# Altium project DCAV32_WINGLET_V1P_OSR.PrjPcb (part 3 of 3)

## Sheet SCH_WINGLET_IO.SchDoc: Winglet Board I/O
size B; DrawnBy: HCAdam; Organization: Aerospace Village; DocumentNumber: WINGLET; Revision: A; SheetNumber: 9; SheetTotal: 10
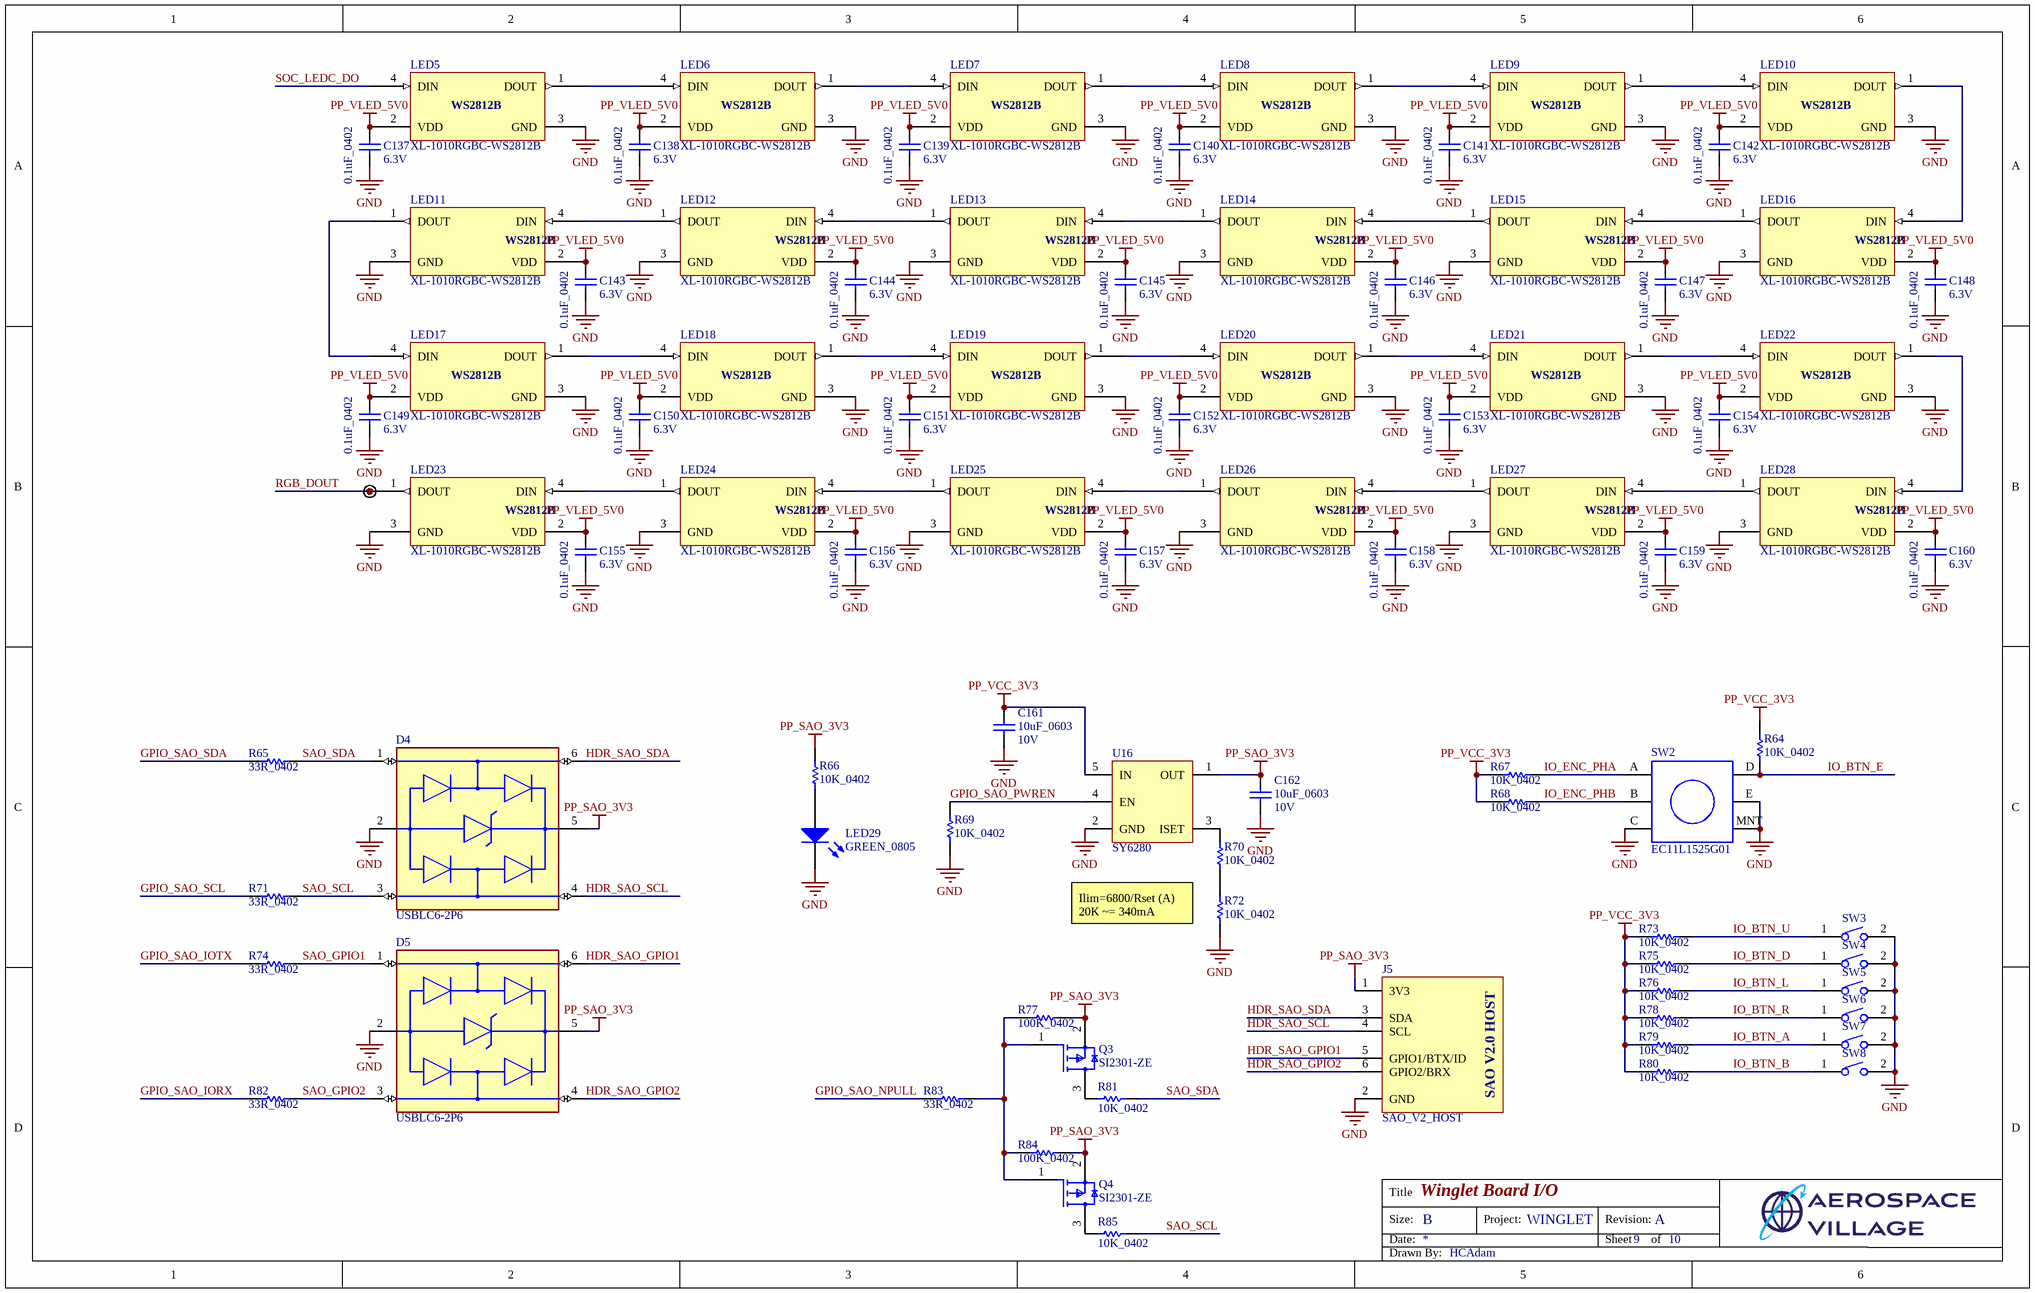
[diagram p8: SCH_WINGLET_IO.SchDoc]

### Parts
C137  0.1uF_0402  Voltage Rating: 6.3V  [CAPC1005X56X25NL10T15]
C138  0.1uF_0402  Voltage Rating: 6.3V  [CAPC1005X56X25NL10T15]
C139  0.1uF_0402  Voltage Rating: 6.3V  [CAPC1005X56X25NL10T15]
C140  0.1uF_0402  Voltage Rating: 6.3V  [CAPC1005X56X25NL10T15]
C141  0.1uF_0402  Voltage Rating: 6.3V  [CAPC1005X56X25NL10T15]
C142  0.1uF_0402  Voltage Rating: 6.3V  [CAPC1005X56X25NL10T15]
C143  0.1uF_0402  Voltage Rating: 6.3V  [CAPC1005X56X25NL10T15]
C144  0.1uF_0402  Voltage Rating: 6.3V  [CAPC1005X56X25NL10T15]
C145  0.1uF_0402  Voltage Rating: 6.3V  [CAPC1005X56X25NL10T15]
C146  0.1uF_0402  Voltage Rating: 6.3V  [CAPC1005X56X25NL10T15]
C147  0.1uF_0402  Voltage Rating: 6.3V  [CAPC1005X56X25NL10T15]
C148  0.1uF_0402  Voltage Rating: 6.3V  [CAPC1005X56X25NL10T15]
C149  0.1uF_0402  Voltage Rating: 6.3V  [CAPC1005X56X25NL10T15]
C150  0.1uF_0402  Voltage Rating: 6.3V  [CAPC1005X56X25NL10T15]
C151  0.1uF_0402  Voltage Rating: 6.3V  [CAPC1005X56X25NL10T15]
C152  0.1uF_0402  Voltage Rating: 6.3V  [CAPC1005X56X25NL10T15]
C153  0.1uF_0402  Voltage Rating: 6.3V  [CAPC1005X56X25NL10T15]
C154  0.1uF_0402  Voltage Rating: 6.3V  [CAPC1005X56X25NL10T15]
C155  0.1uF_0402  Voltage Rating: 6.3V  [CAPC1005X56X25NL10T15]
C156  0.1uF_0402  Voltage Rating: 6.3V  [CAPC1005X56X25NL10T15]
C157  0.1uF_0402  Voltage Rating: 6.3V  [CAPC1005X56X25NL10T15]
C158  0.1uF_0402  Voltage Rating: 6.3V  [CAPC1005X56X25NL10T15]
C159  0.1uF_0402  Voltage Rating: 6.3V  [CAPC1005X56X25NL10T15]
C160  0.1uF_0402  Voltage Rating: 6.3V  [CAPC1005X56X25NL10T15]
C161  10uF_0603  Voltage Rating: 10V  [CAPC1609X100X15NL20]
C162  10uF_0603  Voltage Rating: 10V  [CAPC1609X100X15NL20]
D4  USBLC6-2P6  [FP-SOT-666-MFG]
D5  USBLC6-2P6  [FP-SOT-666-MFG]
J5  SAO_V2_HOST  [SAO_FEMALE]
LED5  XL-1010RGBC-WS2812B  [DFN3127P600-8N]
LED6  XL-1010RGBC-WS2812B  [DFN3127P600-8N]
LED7  XL-1010RGBC-WS2812B  [DFN3127P600-8N]
LED8  XL-1010RGBC-WS2812B  [DFN3127P600-8N]
LED9  XL-1010RGBC-WS2812B  [DFN3127P600-8N]
LED10  XL-1010RGBC-WS2812B  [DFN3127P600-8N]
LED11  XL-1010RGBC-WS2812B  [DFN3127P600-8N]
LED12  XL-1010RGBC-WS2812B  [DFN3127P600-8N]
LED13  XL-1010RGBC-WS2812B  [DFN3127P600-8N]
LED14  XL-1010RGBC-WS2812B  [DFN3127P600-8N]
LED15  XL-1010RGBC-WS2812B  [DFN3127P600-8N]
LED16  XL-1010RGBC-WS2812B  [DFN3127P600-8N]
LED17  XL-1010RGBC-WS2812B  [DFN3127P600-8N]
LED18  XL-1010RGBC-WS2812B  [DFN3127P600-8N]
LED19  XL-1010RGBC-WS2812B  [DFN3127P600-8N]
LED20  XL-1010RGBC-WS2812B  [DFN3127P600-8N]
LED21  XL-1010RGBC-WS2812B  [DFN3127P600-8N]
LED22  XL-1010RGBC-WS2812B  [DFN3127P600-8N]
LED23  XL-1010RGBC-WS2812B  [DFN3127P600-8N]
LED24  XL-1010RGBC-WS2812B  [DFN3127P600-8N]
LED25  XL-1010RGBC-WS2812B  [DFN3127P600-8N]
LED26  XL-1010RGBC-WS2812B  [DFN3127P600-8N]
LED27  XL-1010RGBC-WS2812B  [DFN3127P600-8N]
LED28  XL-1010RGBC-WS2812B  [DFN3127P600-8N]
LED29  GREEN_0805  [0805_A]
Q3  SI2301-ZE  [FP-SOT23-MFG]
Q4  SI2301-ZE  [FP-SOT23-MFG]
R64  10K_0402  [RESC1005X40X25NL05T05]
R65  33R_0402  [RESC1005X40X25NL05T05]
R66  10K_0402  [RESC1005X40X25NL05T05]
R67  10K_0402  [RESC1005X40X25NL05T05]
R68  10K_0402  [RESC1005X40X25NL05T05]
R69  10K_0402  [RESC1005X40X25NL05T05]
R70  10K_0402  [RESC1005X40X25NL05T05]
R71  33R_0402  [RESC1005X40X25NL05T05]
R72  10K_0402  [RESC1005X40X25NL05T05]
R73  10K_0402  [RESC1005X40X25NL05T05]
R74  33R_0402  [RESC1005X40X25NL05T05]
R75  10K_0402  [RESC1005X40X25NL05T05]
R76  10K_0402  [RESC1005X40X25NL05T05]
R77  100K_0402  [RESC1005X40X25NL05T10]
R78  10K_0402  [RESC1005X40X25NL05T05]
R79  10K_0402  [RESC1005X40X25NL05T05]
R80  10K_0402  [RESC1005X40X25NL05T05]
R81  10K_0402  [RESC1005X40X25NL05T05]
R82  33R_0402  [RESC1005X40X25NL05T05]
R83  33R_0402  [RESC1005X40X25NL05T05]
R84  100K_0402  [RESC1005X40X25NL05T10]
R85  10K_0402  [RESC1005X40X25NL05T05]
SW2  EC11L1525G01  [LCSC_ALPS_EC11L1525G01]
SW3  C5127964  [LCSC_SMD_SW_MED]  (value not drawn)
SW4  C5127964  [LCSC_SMD_SW_MED]  (value not drawn)
SW5  C5127964  [LCSC_SMD_SW_MED]  (value not drawn)
SW6  C5127964  [LCSC_SMD_SW_MED]  (value not drawn)
SW7  C5127964  [LCSC_SMD_SW_MED]  (value not drawn)
SW8  C5127964  [LCSC_SMD_SW_MED]  (value not drawn)
TP28  TESTPOINT  [TESTPOINT-0.7MM-SINGLE-LAYER]  (value not drawn)  (no BOM)
U16  SY6280  [SOT95P292X115-5N]

### Nets
GND: C137.1 C138.1 C139.1 C140.1 C141.1 C142.1 C143.1 C144.1 C145.1 C146.1 C147.1 C148.1 C149.1 C150.1 C151.1 C152.1 C153.1 C154.1 C155.1 C156.1 C157.1 C158.1 C159.1 C160.1 C161.1 C162.1 D4.2(GND) D5.2(GND) J5.2(GND) LED5.3(GND) LED6.3(GND) LED7.3(GND) LED8.3(GND) LED9.3(GND) LED10.3(GND) LED11.3(GND) LED12.3(GND) LED13.3(GND) LED14.3(GND) LED15.3(GND) LED16.3(GND) LED17.3(GND) LED18.3(GND) LED19.3(GND) LED20.3(GND) LED21.3(GND) LED22.3(GND) LED23.3(GND) LED24.3(GND) LED25.3(GND) LED26.3(GND) LED27.3(GND) LED28.3(GND) LED29.1(K) R69.2 R72.2 SW2.C SW2.E SW2.MNT SW3.2 SW4.2 SW5.2 SW6.2 SW7.2 SW8.2 U16.2(GND)
PP_SAO_3V3: C162.2 D4.5(VBUS) D5.5(VBUS) J5.1(3V3) Q3.2(S) Q4.2(S) R66.2 R77.2 R84.2 U16.1(OUT)
PP_VCC_3V3: C161.2 R64.2 R67.2 R68.1 R73.2 R75.2 R76.2 R78.2 R79.2 R80.2 U16.5(IN)
PP_VLED_5V0: C137.2 C138.2 C139.2 C140.2 C141.2 C142.2 C143.2 C144.2 C145.2 C146.2 C147.2 C148.2 C149.2 C150.2 C151.2 C152.2 C153.2 C154.2 C155.2 C156.2 C157.2 C158.2 C159.2 C160.2 LED5.2(VDD) LED6.2(VDD) LED7.2(VDD) LED8.2(VDD) LED9.2(VDD) LED10.2(VDD) LED11.2(VDD) LED12.2(VDD) LED13.2(VDD) LED14.2(VDD) LED15.2(VDD) LED16.2(VDD) LED17.2(VDD) LED18.2(VDD) LED19.2(VDD) LED20.2(VDD) LED21.2(VDD) LED22.2(VDD) LED23.2(VDD) LED24.2(VDD) LED25.2(VDD) LED26.2(VDD) LED27.2(VDD) LED28.2(VDD)
GPIO_SAO_IORX: R82.1
GPIO_SAO_IOTX: R74.1
GPIO_SAO_NPULL: R83.1
GPIO_SAO_PWREN: R69.1 U16.4(EN)
GPIO_SAO_SCL: R71.1
GPIO_SAO_SDA: R65.1
HDR_SAO_GPIO1: D5.6(I/O1) J5.5(GPIO1/BTX/ID)
HDR_SAO_GPIO2: D5.4(I/O2) J5.6(GPIO2/BRX)
HDR_SAO_SCL: D4.4(I/O2) J5.4(SCL)
HDR_SAO_SDA: D4.6(I/O1) J5.3(SDA)
IO_BTN_A: R79.1 SW7.1
IO_BTN_B: R80.1 SW8.1
IO_BTN_D: R75.1 SW4.1
IO_BTN_E: R64.1 SW2.D
IO_BTN_L: R76.1 SW5.1
IO_BTN_R: R78.1 SW6.1
IO_BTN_U: R73.1 SW3.1
IO_ENC_PHA: R67.1 SW2.A
IO_ENC_PHB: R68.2 SW2.B
RGB_DOUT: LED23.1(DOUT) TP28.1
SAO_GPIO1: D5.1(I/O1) R74.2
SAO_GPIO2: D5.3(I/O2) R82.2
SAO_SCL: D4.3(I/O2) R71.2 R85.1
SAO_SDA: D4.1(I/O1) R65.2 R81.1
SOC_LEDC_DO: LED5.4(DIN)
NetLED5_1: LED5.1(DOUT) LED6.4(DIN)
NetLED6_1: LED6.1(DOUT) LED7.4(DIN)
NetLED7_1: LED7.1(DOUT) LED8.4(DIN)
NetLED8_1: LED8.1(DOUT) LED9.4(DIN)
NetLED9_1: LED9.1(DOUT) LED10.4(DIN)
NetLED10_1: LED10.1(DOUT) LED16.4(DIN)
NetLED11_1: LED11.1(DOUT) LED17.4(DIN)
NetLED11_4: LED11.4(DIN) LED12.1(DOUT)
NetLED12_4: LED12.4(DIN) LED13.1(DOUT)
NetLED13_4: LED13.4(DIN) LED14.1(DOUT)
NetLED14_4: LED14.4(DIN) LED15.1(DOUT)
NetLED15_4: LED15.4(DIN) LED16.1(DOUT)
NetLED17_1: LED17.1(DOUT) LED18.4(DIN)
NetLED18_1: LED18.1(DOUT) LED19.4(DIN)
NetLED19_1: LED19.1(DOUT) LED20.4(DIN)
NetLED20_1: LED20.1(DOUT) LED21.4(DIN)
NetLED21_1: LED21.1(DOUT) LED22.4(DIN)
NetLED22_1: LED22.1(DOUT) LED28.4(DIN)
NetLED23_4: LED23.4(DIN) LED24.1(DOUT)
NetLED24_4: LED24.4(DIN) LED25.1(DOUT)
NetLED25_4: LED25.4(DIN) LED26.1(DOUT)
NetLED26_4: LED26.4(DIN) LED27.1(DOUT)
NetLED27_4: LED27.4(DIN) LED28.1(DOUT)
NetLED29_2: LED29.2(A) R66.1
NetQ3_1: Q3.1(G) Q4.1(G) R77.1 R83.2 R84.1
NetQ3_3: Q3.3(D) R81.2
NetQ4_3: Q4.3(D) R85.2
NetR70_1: R70.1 U16.3(ISET)
NetR70_2: R70.2 R72.1

### Notes on the sheet
- Ilim=6800/Rset (A)
  20K ~= 340mA
- Title
- Size:
- Date:
- B
- Project:
- Revision:
- Sheet
- of
- Drawn By:
- (in symbol SAO_V2_HOST) SAO V2.0 HOST
- (in symbol XL-1010RGBC-WS2812B) WS2812B

### Library data of the parts
C137-C160 = CMP-2008-02743-1: 04026D104KAT2A; Manufacturer: AVX Interconnect / Elco; Part Number: 04026D104KAT2A
C161 C162 = CMP-2006-00191-1: Part Number: TACL106M006XTA; Manufacturer: AVX Interconnect / Elco
D4 D5 = CMP-12225-000058-1: TVS DIODE 5.25V 17V SOT666; Min Breakdown Voltage: 6V; Power Line Protection: Yes; Element Configuration: Dual; Test Current: 1mA; Working Voltage: 5V; Number of Channels: 2; Max Reverse Leakage Current: 150nA; Direction: Unidirectional; Peak Pulse Current: 5A; Number of Elements: 1; Capacitance: 3.5pF; Max Breakdown Voltage: 6V; Height: 0.6mm; Depth: 1.3mm; Contact Plating: Tin; Reverse Breakdown Voltage: 6V; REACH SVHC: No SVHC; Operating Supply Voltage: 5V; Width: 1.3mm; Max Operating Temperature: 125°C; Reverse Standoff Voltage: 5V; ESD Protection: Yes; Package Quantity: 1; Termination: SMD/SMT; Length: 1.7mm; Leakage Current: 150nA; Number of Bidirectional Channels: 2; Case/Package: SOT-666; Min Operating Temperature: -40°C; Number of Pins: 6; Clamping Voltage: 17V; Breakdown Voltage: 6V; Lead Free: Lead Free; Radiation Hardening: No; Packaging: Tape and Reel; Mount: Surface Mount; Polarity: Unidirectional
J5 = SAO_V2_HOST: SAO V2 Host (Female) Side
LED5-LED28 = XL-1010RGBC-WS2812B: 1010 RGB WS2812B LED 3.5-5.5V
LED29 = CMP-1426-00007-1: SMD mono-color Chip LED, WL-SMCW, Green / 150080GS75000; Manufacturer: Wuerth Elektronik; PackageReference: 0805_A; Color: Green; PartNumber: 150080GS75000; ComponentLink2URL: http://katalog.we-online.com/led/datasheet/150080GS75000.pdf; ComponentLink1URL: http://www.we-online.com; ComponentLink1Description: Manufacturer URL; ComponentLink2Description: Datasheet
Q3 Q4 = CMP-12801-000062-2: MOSFET P-CH 30V SOT23; Gate to Source Voltage (Vgs): 20V; Turn-Off Delay Time: 31ns; Drain to Source Voltage (Vdss): -30V; Fall Time: 15ns; Threshold Voltage: -2.1V; Rise Time: 5ns; Input Capacitance: 563pF; Number of Channels: 1; Drain to Source Resistance: 65mR; Element Configuration: Single; Max Power Dissipation: 1.08W; Turn-On Delay Time: 4.8ns; Continuous Drain Current (ID): 3.8A; Lead Free: Lead Free; Number of Pins: 3; Package Quantity: 3000; Width: 1.4mm; Radiation Hardening: No; Mount: Surface Mount; Case/Package: SOT-23; Contact Plating: Tin; Rds On Max: 65mR; Height: 1.1mm; REACH SVHC: No SVHC; Weight: 0.000282oz; Max Operating Temperature: 150°C; Packaging: Tape and Reel; Min Operating Temperature: -55°C; Length: 3mm
R64 R66-R70 R72 R73 R75 R76 R78-R81 R85 = CMP-2000-07588-1: Chip Resistor, 10 KOhm, +/- 1%, 0.1 W, -55 to 155 degC, 0402 (1005 Metric), RoHS, Tape and Reel / ERJ2RKF1002X; Manufacturer: Panasonic; Power Rating: 100mW; Voltage Rating: 50V; Resistance: 10KOhm; Case\/Package: 0402; Temperature Coefficient: 100ppm\/degreesC; RoHSCompliant: True; Lead Free: LeadFree; Package Quantity: 1; Contact Plating: Tin; Length: 1mm; Radiation Hardening: No; REACH SVHC: NoSVHC; Max Operating Temperature: 155degC; Depth: 0.5mm; Case Code (Imperial): 0402; Military Standard: Not; Package Description: 2-Pin Surface Mount Device, Body 1 x 0.5 mm; Termination: SMD/SMT; Case Code (Metric): 1005; Height: 0.35mm; Packaging: TapeandReel; Voltage Rating (DC): 50V; Package Reference: 402; Number of Pins: 2; Tolerance: 1%; Mounting Technology: SurfaceMount; Width: 0.02inch; Mount: SurfaceMount; Datasheet URL: https://industrial.panasonic.com/cdbs/www-data/pdf/RDA0000/AOA0000C304.pdf; Composition: ThickFilm; Datasheet Version: 02/2017; Manufacturer URL: http://www.panasonic.com/; Max Power Dissipation: 100mW; Number of Terminations: 2; Min Operating Temperature: -55degC
R65 R71 R74 R82 R83 = CMP-2002-01146-1: ERJ2RKF33R0X; Manufacturer: Panasonic; Part Number: ERJ2RKF33R0X
R77 R84 = CMP-2002-07343-1: RC0402FR-07100KL; Manufacturer: Yageo / Phycomp; Part Number: RC0402FR-07100KL
SW2 = EC11L1525G01: EC11L1525G01 Rotary Encoder with Pushbutton
SW3-SW8 = SMD_SW_MED: SMD SPST Tactile Switch / C5127964
TP28 = TP_07: TESTPOINT SINGLE LAYER 0.7MM; AEC-Q: Yes; PPAP: Unknown; Selective Soldering: No; Value: Unknown; RoHS: Yes; Package: BOARD_FEATURE; Washable: Yes; Mounting: Unknown
U16 = SY6280: Low Loss Power Distribution Switch

## Sheet SCH_WINGLET_DEBUG.SchDoc: Winglet Debug
size B; DrawnBy: HCAdam; Organization: Aerospace Village; DocumentNumber: WINGLET; Revision: A; SheetNumber: 10; SheetTotal: 10
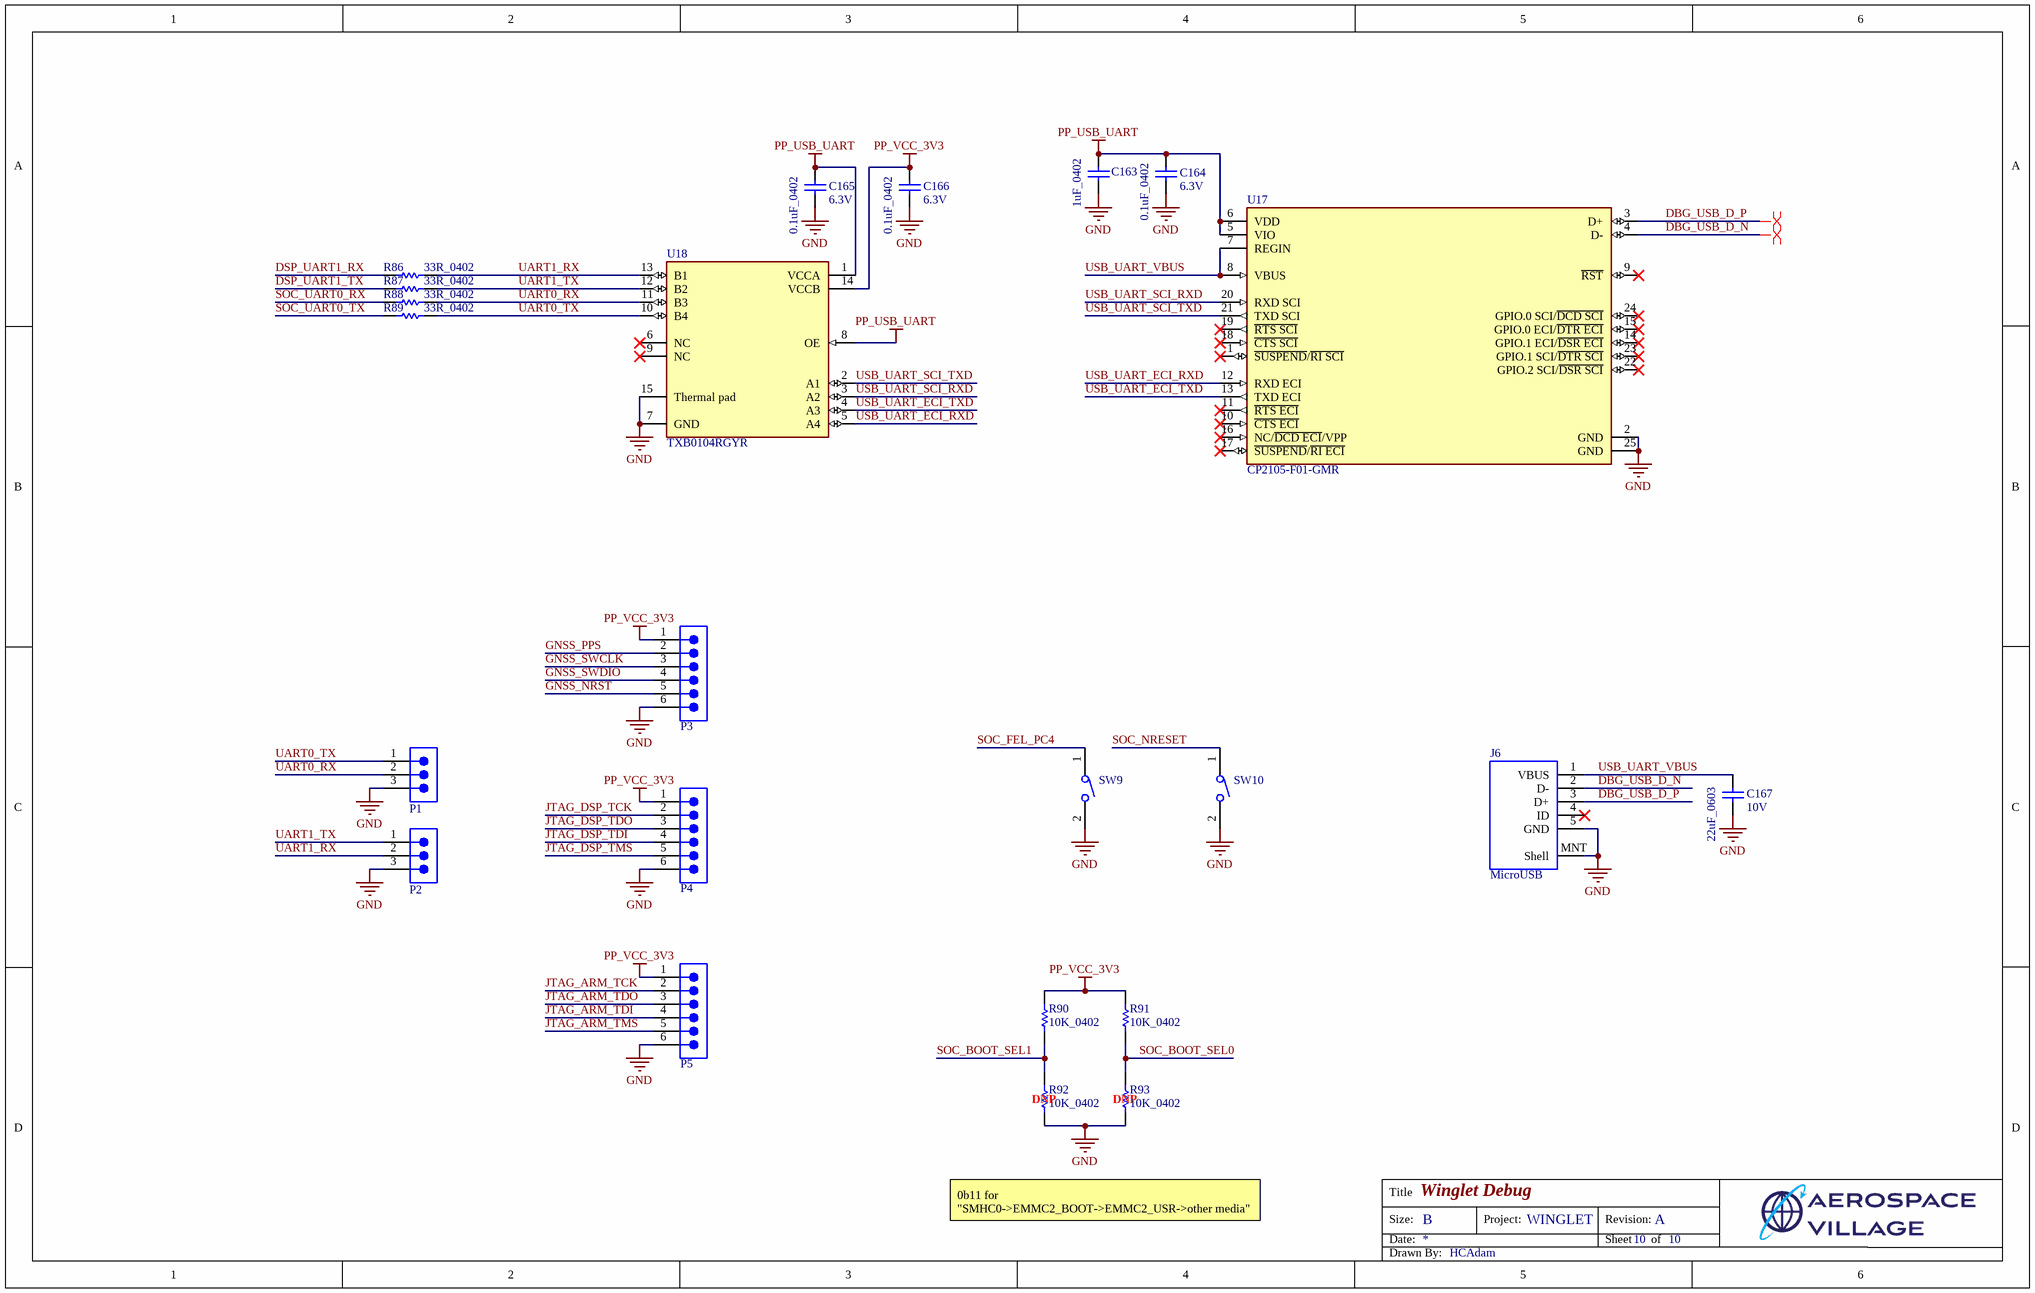
[diagram p9: SCH_WINGLET_DEBUG.SchDoc]

### Parts
C163  1uF_0402  [CAPC1005X55X25NL5T10]
C164  0.1uF_0402  Voltage Rating: 6.3V  [CAPC1005X56X25NL10T15]
C165  0.1uF_0402  Voltage Rating: 6.3V  [CAPC1005X56X25NL10T15]
C166  0.1uF_0402  Voltage Rating: 6.3V  [CAPC1005X56X25NL10T15]
C167  22uF_0603  Voltage Rating: 10V  [CAPC1608X100X20NL10]
J6  MicroUSB  [LCSC_MicroQTJ]
P1  TSW-103-07-G-S  [SMTC-TSW-103-07-X-S]  (value not drawn)
P2  TSW-103-07-G-S  [SMTC-TSW-103-07-X-S]  (value not drawn)
P3  TSW-106-07-F-S  [SMTC-TSW-106-07-X-S]  (value not drawn)
P4  TSW-106-07-F-S  [SMTC-TSW-106-07-X-S]  (value not drawn)
P5  TSW-106-07-F-S  [SMTC-TSW-106-07-X-S]  (value not drawn)
R86  33R_0402  [RESC1005X40X25NL05T05]
R87  33R_0402  [RESC1005X40X25NL05T05]
R88  33R_0402  [RESC1005X40X25NL05T05]
R89  33R_0402  [RESC1005X40X25NL05T05]
R90  10K_0402  [RESC1005X40X25NL05T05]
R91  10K_0402  [RESC1005X40X25NL05T05]
R92  10K_0402  [RESC1005X40X25NL05T05]
R93  10K_0402  [RESC1005X40X25NL05T05]
SW9  GT-TC029B-H025-L1N  [LCSC_SMD_SW_SMALL]  (value not drawn)
SW10  GT-TC029B-H025-L1N  [LCSC_SMD_SW_SMALL]  (value not drawn)
U17  CP2105-F01-GMR  [FP-CP2105-F01-GMR-MFG]
U18  TXB0104RGYR  [FP-RGY0014A-MFG]

### Nets
GND: C163.1 C164.1 C165.1 C166.1 C167.1 J6.5(GND) J6.MNT(Shell) P1.3 P2.3 P3.6 P4.6 P5.6 R92.2 R93.2 SW9.2 SW10.2 U17.2(GND) U17.25(GND) U18.7(GND) U18.15(Thermal_pad)
PP_USB_UART: C163.2 C164.2 C165.2 U17.5(VIO) U17.6(VDD) U18.1(VCCA) U18.8(OE)
PP_VCC_3V3: C166.2 P3.1 P4.1 P5.1 R90.1 R91.1 U18.14(VCCB)
DBG_USB_D_N: J6.2(D-) U17.4(D-)
DBG_USB_D_P: J6.3(D+) U17.3(D+)
DSP_UART1_RX: R86.1
DSP_UART1_TX: R87.1
GNSS_NRST: P3.5
GNSS_PPS: P3.2
GNSS_SWCLK: P3.3
GNSS_SWDIO: P3.4
JTAG_ARM_TCK: P5.2
JTAG_ARM_TDI: P5.4
JTAG_ARM_TDO: P5.3
JTAG_ARM_TMS: P5.5
JTAG_DSP_TCK: P4.2
JTAG_DSP_TDI: P4.4
JTAG_DSP_TDO: P4.3
JTAG_DSP_TMS: P4.5
SOC_BOOT_SEL0: R91.2 R93.1
SOC_BOOT_SEL1: R90.2 R92.1
SOC_FEL_PC4: SW9.1
SOC_NRESET: SW10.1
SOC_UART0_RX: R88.1
SOC_UART0_TX: R89.1
UART0_RX: P1.2 R88.2 U18.11(B3)
UART0_TX: P1.1 R89.2 U18.10(B4)
UART1_RX: P2.2 R86.2 U18.13(B1)
UART1_TX: P2.1 R87.2 U18.12(B2)
USB_UART_ECI_RXD: U17.12(RXD_ECI) U18.5(A4)
USB_UART_ECI_TXD: U17.13(TXD_ECI) U18.4(A3)
USB_UART_SCI_RXD: U17.20(RXD_SCI) U18.3(A2)
USB_UART_SCI_TXD: U17.21(TXD_SCI) U18.2(A1)
USB_UART_VBUS: C167.2 J6.1(VBUS) U17.7(REGIN) U17.8(VBUS)

Not connected (* = marked no-connect by the designer): J6 4(ID)*; U17 1(~{SUSPEND}/~{RI_SCI})* 9(~{RST})* 10(~{CTS_ECI})* 11(~{RTS_ECI})* 14(GPIO.1_ECI/~{DSR_ECI})* 15(GPIO.0_ECI/~{DTR_ECI})* 16(NC/~{DCD_ECI}/VPP)* 17(~{SUSPEND}/~{RI_ECI})* 18(~{CTS_SCI})* 19(~{RTS_SCI})* 22(GPIO.2_SCI/~{DSR_SCI})* 23(GPIO.1_SCI/~{DTR_SCI})* 24(GPIO.0_SCI/~{DCD_SCI})*; U18 6(NC)* 9(NC)*

### Layout directives
differential pair: DBG_USB_D_N, DBG_USB_D_P

### Notes on the sheet
- 0b11 for "SMHC0->EMMC2_BOOT->EMMC2_USR->other media"
- Title
- Size:
- Date:
- B
- Project:
- Revision:
- Sheet
- of
- Drawn By:

### Library data of the parts
C163 = CMP-1662-00020-1: Chip Capacitor, 1 uF, +/- 10%, 6.3 V, -55 to 85 degC, 0402 (1005 Metric), RoHS, Tape and Reel / GRM155R60J105KE19D; Voltage Rating (DC): 3 V; Type (Capacitors): X5R; Voltage Rating: 6.3 V; Capacitance: 1 uF; ComponentLink2Description: Datasheet; ComponentLink2URL: http://psearch.en.murata.com/capacitor/product/GRM155R60J105KE19%23.pdf; Max Operating Temperature: 85 degC; Min Operating Temperature: -55 degC; Package Quantity: 10000; Mounting Technology: Surface Mount; ComponentLink1Description: Manufacturer URL; ComponentLink1URL: http://www.murata.com/; PackageDescription: 2-Pin Surface Mount Device, Body 1 x 0.5 mm; Tolerance: 10%; Case/Package: 0402; Mount: Surface Mount; Packaging: Tape and Reel; Case Code (Metric): 1005; Radiation Hardening: No; Width: 0.5 mm; Length: 1 mm; DatasheetVersion: 08/2016; Height: 0.5 mm; PartNumber: GRM155R60J105KE19D; RoHSCompliant: true; Case Code (Imperial): 0402; REACH SVHC: No SVHC; Pins: 2
C164-C166 = CMP-2008-02743-1: as C137-C160 on sheet SCH_WINGLET_IO; Part Number: 04026D104KAT2A
C167 = CMP-2000-05441-1: Chip Capacitor, 22 uF, +/- 20%, 10 V, -55 to 85 degC, 0603 (1608 Metric), RoHS, Tape and Reel / PN: C1608X5R1A226M080AC; Manufacturer: TDK; PCN Part Number: MLCCPartNumberChange30/Nov/2012; Product Training Modules: CSeriesGeneralApplicationsSEAT,CCV,andTVCLDesignToolsGuidetoReplacinganElectrolyticCapacitorwithanMLCC; Other Names: 445-9077-1; Design Resources: 20WNon-IsolatedBuckLEDDriverUsingPLLNK460KG; Online Catalog: CSeries,GeneralPurpose; Capacitance: 22µF; Temperature Coefficient: X5R; Kits: 445-9014-KIT-ND-KITMLCC100PF-22UF060310-50V; Packaging: CutTape(CT); Standard Package: 1; Package / Case: 0603(1608Metric); Lead Style: -; Features: -; Ratings: -; Voltage - Rated: 10V; Operating Temperature: -55degC~85degC; Applications: GeneralPurpose; Package Reference: 603; Datasheet URL: http://download.siliconexpert.com/pdfs/2015/4/21/15/54/45/779/tdk_/manual/37024850441143360mlcc_commercial_general_en.pdf; Datasheet Version: Mar-15; Mounting Type: SurfaceMount,MLCC; Lead Spacing: -; Size / Dimension: 0.063"Lx0.031"W(1.60mmx0.80mm); Height - Seated (Max): -; Package Description: 2-Pin Surface Mount Device, Body 1.6 x 0.8 mm; Manufacturer URL: http://www.tdk.com/; RoHS Information: RoHSCertificate-MLCC; Tolerance: ±20%; Series: C; Thickness (Max): 0.035"(0.90mm); Family: CeramicCapacitors; Category: Capacitors
J6 = MicroQTJ: MicroQTJ MicroUSB CONN
P1 P2 = CMP-1024-00333-1: 0.025" SQ Post Header, Through-hole, Vertical, -55 to 125 degC, 2.54 mm Pitch, 3-Pin, Male, RoHS; Manufacturer: Samtec; Pitch: 2.54 mm; ComponentLink3URL: http://www.samtec.com/documents/webfiles/cpdf/TSW-XXX-XX-XXX-X-XX-XXX-MKT.pdf; Temperature Range: -55 to 125 degC; DatasheetVersion: F-214; ComponentLink1Description: Manufacturer URL; ComponentLink2URL: http://www.samtec.com/documents/webfiles/pdf/TSW_TH.PDF; RoHS: True; Orientation: Vertical; ComponentLink2Description: Datasheet; ComponentLink3Description: Package Specification; PackageDescription: .025[0.64] SQ. Post Terminal Strip Assembly; Mounting Technology: Through-hole; PackageVersion: DM, 8/1988; ComponentLink1URL: http://www.samtec.com; PackageReference: TSW-103-07-X-S; PartNumber: TSW-103-07-G-S
P3-P5 = CMP-1024-00385-1: 0.025" SQ Post Header, Through-hole, Vertical, -55 to 125 degC, 2.54 mm Pitch, 6-Pin, Male, RoHS; Manufacturer: Samtec; Pitch: 2.54 mm; Orientation: Vertical; RoHS: True; ComponentLink3Description: Package Specification; PartNumber: TSW-106-07-F-S; Temperature Range: -55 to 125 degC; PackageVersion: DM, 8/1988; ComponentLink2URL: http://www.samtec.com/documents/webfiles/pdf/TSW_TH.PDF; ComponentLink1Description: Manufacturer URL; ComponentLink2Description: Datasheet; ComponentLink1URL: http://www.samtec.com; DatasheetVersion: F-214; PackageReference: TSW-106-07-X-S; PackageDescription: .025[0.64] SQ. Post Terminal Strip Assembly; ComponentLink3URL: http://www.samtec.com/documents/webfiles/cpdf/TSW-XXX-XX-XXX-X-XX-XXX-MKT.pdf; Mounting Technology: Through-hole
R86-R89 = CMP-2002-01146-1: ERJ2RKF33R0X; Manufacturer: Panasonic; Part Number: ERJ2RKF33R0X
R90-R93 = CMP-2000-07588-1: as R64 on sheet SCH_WINGLET_IO; RoHSCompliant: True; Lead Free: LeadFree; Package Quantity: 1; Contact Plating: Tin; Length: 1mm; Radiation Hardening: No; REACH SVHC: NoSVHC; Max Operating Temperature: 155degC; Depth: 0.5mm; Case Code (Imperial): 0402; Military Standard: Not; Package Description: 2-Pin Surface Mount Device, Body 1 x 0.5 mm; Termination: SMD/SMT; Case Code (Metric): 1005; Height: 0.35mm; Packaging: TapeandReel; Voltage Rating (DC): 50V; Package Reference: 402; Number of Pins: 2; Tolerance: 1%; Mounting Technology: SurfaceMount; Width: 0.02inch; Mount: SurfaceMount; Datasheet URL: https://industrial.panasonic.com/cdbs/www-data/pdf/RDA0000/AOA0000C304.pdf; Composition: ThickFilm; Datasheet Version: 02/2017; Manufacturer URL: http://www.panasonic.com/; Max Power Dissipation: 100mW; Number of Terminations: 2; Min Operating Temperature: -55degC
  R92 R93: DNP: DNP
SW9 SW10 = GT-TC029B-H025-L1N: SMD SPST Tactile Switch / C843669
U17 = CMP-08107-000002-1: IC SGL USB-DL UART BRIDGE 24QFN; Manufacturer: Silicon Labs; Standoff Height: 0mm; Max Supply Voltage: 5.25V; Min Supply Voltage: 1.8V; Function: Bridge, USB to UART; Interface: UART,USB; Nominal Supply Current: 17mA; Height: 0.8mm; Ambient Temperature Range High: +125°C; Ipc Land Pattern Name: QFN50P400X400X75-24; Mouser Description: I/O Controller Interface IC USB to Dual UART bridge; Octopart: https://octopart.com/cp2105-f01-gmr-silicon+labs-19668643; Automotive: No; RoHS: TRUE; Manufacturer Part Number: CP2105-F01-GMR; Temperature: -40°C to +85°C; Temperature Range Low: -40°C; Temperature Range High: +85°C; Category: IC; ComponentLink2Description: Datasheet; Digikey Description: IC SGL USB-DL UART BRIDGE 24QFN; Device Class L1: Integrated Circuits (ICs); Device Class L2: Interface ICs; Ambient Temperature Range Low: -55°C; Package: CP2105-F01-GMR; Device Class L3: Controllers; Lead Free: Yes; ComponentLink2URL: https://www.silabs.com/documents/public/data-sheets/CP2105.pdf
U18 = CMP-04899-000011-1: IC TRNSLTR BIDIRECTIONAL 14VQFN; Manufacturer: Texas Instruments; Standoff Height: 0mm; V B Min: 1.65V; Data Rate: 100Mbits/s; Number Of Circuits: 1; V B Max: 5.5V; Number Of Inputs: 4; Logic Function Desc: Non-Inverting; Max Junction Temp: +150°C; V A Min: 1.2V; Nominal Supply Current: 0.06-3.5uA; V A Max: 3.6V; Propagation Delay: 4ns; Device Class L1: Integrated Circuits (ICs); ComponentLink2Description: Datasheet; Mouser Description: 4-Bit Bidirectional Voltage-Level Shifter with Auto Direction Sensing and +/-15 kV ESD Protect 14-VQFN -40 to 85; Ambient Temperature Range Low: -40°C; Temperature: -40°C to +85°C; RoHS: TRUE; Digikey Description: IC TRNSLTR BIDIRECTIONAL 14VQFN; Manufacturer Part Number: TXB0104RGYR; Lead Free: Yes; Octopart: https://octopart.com/txb0104rgyr-texas+instruments-1485948; Height: 1mm; Device Class L3: Voltage Level Shifters; Category: IC; Device Class L2: Logic ICs; Temperature Range Low: -40°C; Number Of Outputs: 4; Temperature Range High: +85°C; Package: RGY0014A; Automotive: No; Ambient Temperature Range High: +85°C; Min Supply Voltage: 1.2V; ComponentLink2URL: http://www.ti.com/lit/ds/symlink/txb0104.pdf; Max Supply Voltage: 5.5V

## Nets that join several sheets
GND: SCH_WINGLET_BMU (30 pins), SCH_WINGLET_PWR (42 pins), SCH_WINGLET_SOC (19 pins), SCH_WINGLET_SD_MMC (20 pins), SCH_WINGLET_DISP (15 pins), SCH_WINGLET_WIFI (22 pins), SCH_WINGLET_GNSS (32 pins), SCH_WINGLET_ADSB (47 pins), SCH_WINGLET_IO (66 pins), SCH_WINGLET_DEBUG (20 pins)
PP_BMU_1V8: SCH_WINGLET_BMU (C16.2 R1.1 TP3.1 U1.2), SCH_WINGLET_PWR (R24.2), SCH_WINGLET_GNSS (D3.2)
PP_LDOA_1V8: SCH_WINGLET_PWR (6 pins), SCH_WINGLET_SOC (6 pins), SCH_WINGLET_DISP (C70.2 U4.65)
PP_VCC_3V3: SCH_WINGLET_BMU (R2.1 R3.1 R4.1), SCH_WINGLET_PWR (15 pins), SCH_WINGLET_SOC (6 pins), SCH_WINGLET_SD_MMC (18 pins), SCH_WINGLET_DISP (7 pins), SCH_WINGLET_WIFI (FB1.1), SCH_WINGLET_GNSS (FB2.1), SCH_WINGLET_ADSB (FB3.1), SCH_WINGLET_IO (11 pins), SCH_WINGLET_DEBUG (7 pins)
PP_VLED_5V0: SCH_WINGLET_BMU (5 pins), SCH_WINGLET_DISP (C73.2 U6.4), SCH_WINGLET_IO (48 pins)
PP_VSYS: SCH_WINGLET_BMU (6 pins), SCH_WINGLET_PWR (5 pins)
BMU_IRQ: SCH_WINGLET_BMU (R2.2 U1.29), SCH_WINGLET_SOC (U4.118)
BMU_OTG: SCH_WINGLET_BMU (R6.2 U1.3), SCH_WINGLET_SOC (U4.119)
BMU_TWI2_SCL: SCH_WINGLET_BMU (R4.2 U1.32), SCH_WINGLET_SOC (U4.126)
BMU_TWI2_SDA: SCH_WINGLET_BMU (R3.2 U1.1), SCH_WINGLET_SOC (U4.127)
DSP_UART1_RX: SCH_WINGLET_SOC (U4.2), SCH_WINGLET_DEBUG (R86.1)
DSP_UART1_TX: SCH_WINGLET_SOC (U4.1), SCH_WINGLET_DEBUG (R87.1)
GNSS_NRST: SCH_WINGLET_GNSS (U10.17), SCH_WINGLET_DEBUG (P3.5)
GNSS_PPS: SCH_WINGLET_GNSS (U10.35), SCH_WINGLET_DEBUG (P3.2)
GNSS_SWCLK: SCH_WINGLET_GNSS (U10.15), SCH_WINGLET_DEBUG (P3.3)
GNSS_SWDIO: SCH_WINGLET_GNSS (U10.16), SCH_WINGLET_DEBUG (P3.4)
GPIO_ADSB_ASW: SCH_WINGLET_SOC (U4.120), SCH_WINGLET_ADSB (R52.2 R53.2 R57.2)
GPIO_SAO_IORX: SCH_WINGLET_SOC (U4.82), SCH_WINGLET_IO (R82.1)
GPIO_SAO_IOTX: SCH_WINGLET_SOC (R27.2 U4.84), SCH_WINGLET_IO (R74.1)
GPIO_SAO_NPULL: SCH_WINGLET_SOC (U4.122), SCH_WINGLET_IO (R83.1)
GPIO_SAO_PWREN: SCH_WINGLET_SOC (U4.123), SCH_WINGLET_IO (R69.1 U16.4)
GPIO_SAO_SCL: SCH_WINGLET_SOC (U4.85), SCH_WINGLET_IO (R71.1)
GPIO_SAO_SDA: SCH_WINGLET_SOC (U4.86), SCH_WINGLET_IO (R65.1)
IO_BTN_A: SCH_WINGLET_SOC (U4.6), SCH_WINGLET_IO (R79.1 SW7.1)
IO_BTN_B: SCH_WINGLET_SOC (U4.124), SCH_WINGLET_IO (R80.1 SW8.1)
IO_BTN_D: SCH_WINGLET_SOC (U4.44), SCH_WINGLET_IO (R75.1 SW4.1)
IO_BTN_E: SCH_WINGLET_SOC (U4.5), SCH_WINGLET_IO (R64.1 SW2.D)
IO_BTN_L: SCH_WINGLET_SOC (U4.32), SCH_WINGLET_IO (R76.1 SW5.1)
IO_BTN_R: SCH_WINGLET_SOC (U4.31), SCH_WINGLET_IO (R78.1 SW6.1)
IO_BTN_U: SCH_WINGLET_SOC (U4.45), SCH_WINGLET_IO (R73.1 SW3.1)
IO_ENC_PHA: SCH_WINGLET_SOC (U4.3), SCH_WINGLET_IO (R67.1 SW2.A)
IO_ENC_PHB: SCH_WINGLET_SOC (U4.4), SCH_WINGLET_IO (R68.2 SW2.B)
JTAG_ARM_TCK: SCH_WINGLET_SOC (U4.36), SCH_WINGLET_DEBUG (P5.2)
JTAG_ARM_TDI: SCH_WINGLET_SOC (U4.38), SCH_WINGLET_DEBUG (P5.4)
JTAG_ARM_TDO: SCH_WINGLET_SOC (U4.37), SCH_WINGLET_DEBUG (P5.3)
JTAG_ARM_TMS: SCH_WINGLET_SOC (U4.39), SCH_WINGLET_DEBUG (P5.5)
JTAG_DSP_TCK: SCH_WINGLET_SOC (U4.40), SCH_WINGLET_DEBUG (P4.2)
JTAG_DSP_TDI: SCH_WINGLET_SOC (U4.42), SCH_WINGLET_DEBUG (P4.4)
JTAG_DSP_TDO: SCH_WINGLET_SOC (U4.41), SCH_WINGLET_DEBUG (P4.3)
JTAG_DSP_TMS: SCH_WINGLET_SOC (U4.43), SCH_WINGLET_DEBUG (P4.5)
RTL_USB_D_N: SCH_WINGLET_SOC (U4.113), SCH_WINGLET_WIFI (U7.16)
RTL_USB_D_P: SCH_WINGLET_SOC (U4.112), SCH_WINGLET_WIFI (U7.15)
SOC_24M_XI: SCH_WINGLET_PWR (U4.23), SCH_WINGLET_SOC (C56.2 X2.1)
SOC_24M_XO: SCH_WINGLET_PWR (TP6.1 U4.22), SCH_WINGLET_SOC (C57.2 X2.3)
SOC_32K_XI: SCH_WINGLET_PWR (U4.25), SCH_WINGLET_SOC (C48.2 X1.2)
SOC_32K_XO: SCH_WINGLET_PWR (TP5.1 U4.24), SCH_WINGLET_SOC (C49.2 X1.1)
SOC_BOOT_SEL0: SCH_WINGLET_SD_MMC (R34.2), SCH_WINGLET_DEBUG (R91.2 R93.1)
SOC_BOOT_SEL1: SCH_WINGLET_SD_MMC (R33.2), SCH_WINGLET_DEBUG (R90.2 R92.1)
SOC_FEL_PC4: SCH_WINGLET_SD_MMC (R35.2), SCH_WINGLET_DEBUG (SW9.1)
SOC_LEDC_DO: SCH_WINGLET_SOC (U4.125), SCH_WINGLET_IO (LED5.4)
SOC_NRESET: SCH_WINGLET_PWR (5 pins), SCH_WINGLET_DEBUG (SW10.1)
SOC_PF6_CD: SCH_WINGLET_SOC (U4.13), SCH_WINGLET_SD_MMC (J2.CD R29.2)
SOC_PG3_LCS: SCH_WINGLET_SOC (U4.121), SCH_WINGLET_DISP (R39.1)
SOC_SDC0_CLK: SCH_WINGLET_SOC (U4.9), SCH_WINGLET_SD_MMC (R30.1)
SOC_SDC0_CMD: SCH_WINGLET_SOC (U4.10), SCH_WINGLET_SD_MMC (J2.3 R31.2 TP13.1)
SOC_SDC0_D0: SCH_WINGLET_SOC (U4.8), SCH_WINGLET_SD_MMC (J2.7 TP14.1)
SOC_SDC0_D1: SCH_WINGLET_SOC (U4.7), SCH_WINGLET_SD_MMC (J2.8 TP15.1)
SOC_SDC0_D2: SCH_WINGLET_SOC (U4.12), SCH_WINGLET_SD_MMC (J2.1 TP16.1)
SOC_SDC0_D3: SCH_WINGLET_SOC (U4.11), SCH_WINGLET_SD_MMC (J2.2 TP17.1)
SOC_SDC2_CLK: SCH_WINGLET_SOC (U4.19), SCH_WINGLET_SD_MMC (R32.1)
SOC_SDC2_CMD: SCH_WINGLET_SOC (U4.18), SCH_WINGLET_SD_MMC (TP21.1 U5.M5)
SOC_SDC2_D0: SCH_WINGLET_SOC (U4.15), SCH_WINGLET_SD_MMC (TP19.1 U5.A3)
SOC_SDC2_D1: SCH_WINGLET_SOC (U4.16), SCH_WINGLET_SD_MMC (R33.1 TP20.1 U5.A4)
SOC_SDC2_D2: SCH_WINGLET_SOC (U4.17), SCH_WINGLET_SD_MMC (R34.1 R35.1 TP22.1 U5.A5)
SOC_SDC2_D3: SCH_WINGLET_SOC (U4.14), SCH_WINGLET_SD_MMC (TP23.1 U5.B2)
SOC_TVIN0: SCH_WINGLET_SOC (U4.108), SCH_WINGLET_ADSB (C130.1)
SOC_UART0_RX: SCH_WINGLET_SOC (U4.33), SCH_WINGLET_DEBUG (R88.1)
SOC_UART0_TX: SCH_WINGLET_SOC (U4.35), SCH_WINGLET_DEBUG (R89.1)
SOC_UART3_RX: SCH_WINGLET_SOC (U4.79), SCH_WINGLET_GNSS (R50.2)
SOC_UART3_TX: SCH_WINGLET_SOC (U4.80), SCH_WINGLET_GNSS (R51.2)
SOC_USB_D_N: SCH_WINGLET_BMU (D1.6 U1.23), SCH_WINGLET_SOC (TP11.1 U4.114)
SOC_USB_D_P: SCH_WINGLET_BMU (D1.4 U1.24), SCH_WINGLET_SOC (TP10.1 U4.115)